# Altium project bottom board.PrjPcb
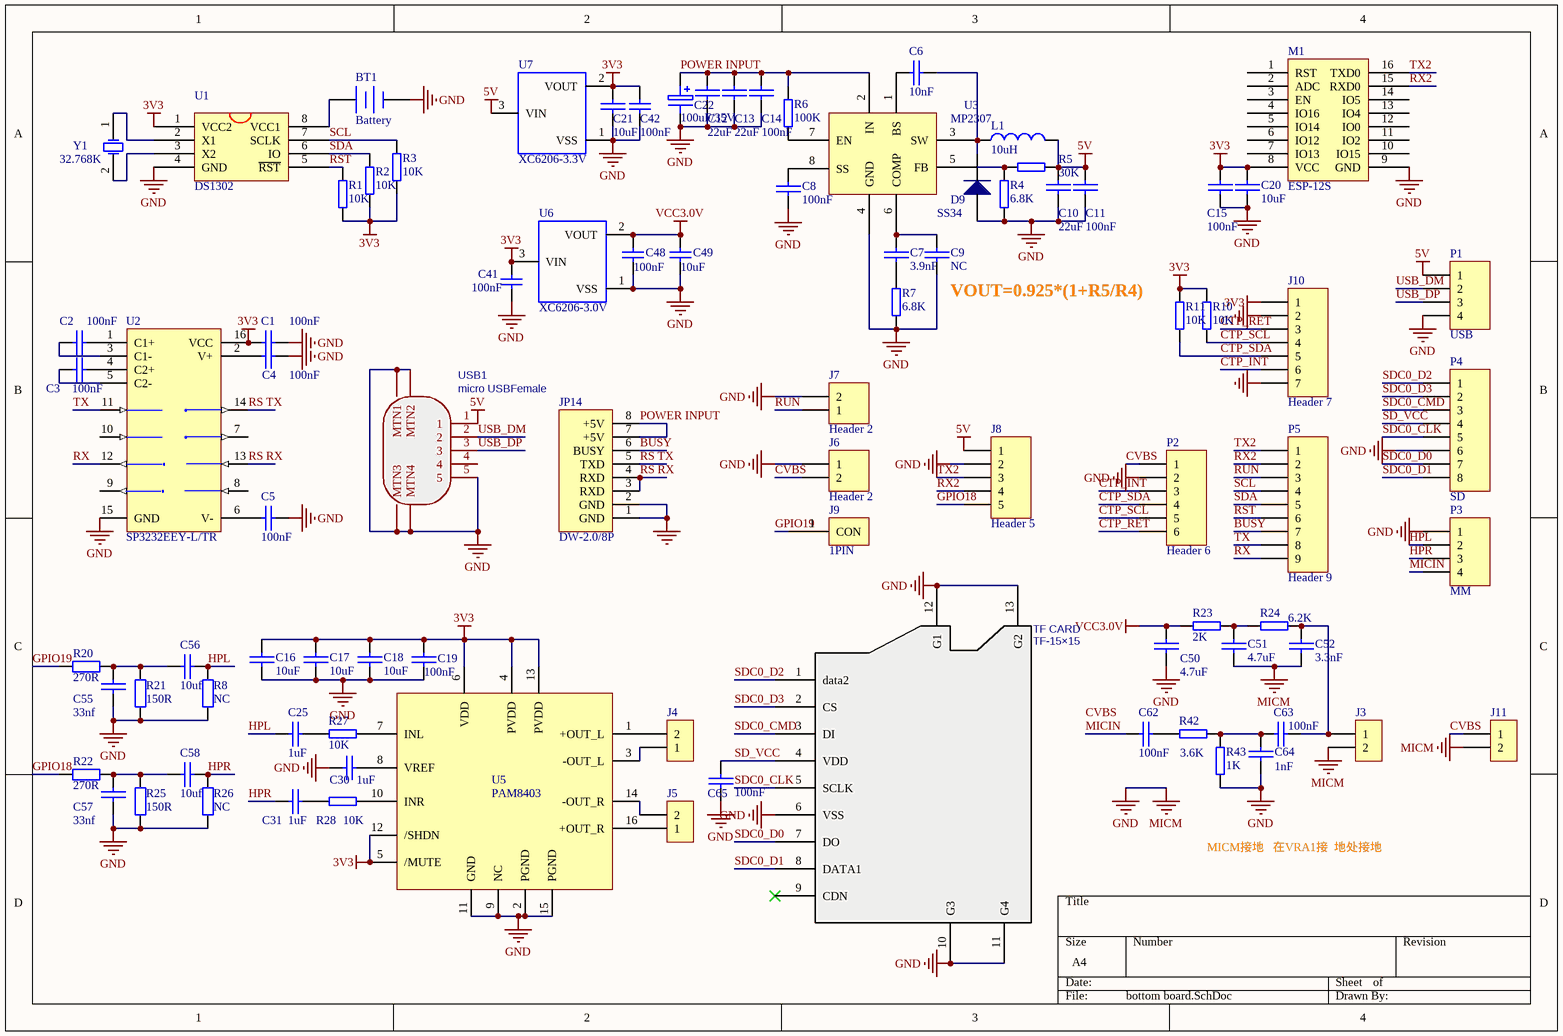
[diagram p0: bottom board.SchDoc]
1 sheet, 89 parts. Net scope: global (net labels, ports and power ports of the same name join across sheets).
Board file: bottom board.PcbDoc

## Sheet bottom board.SchDoc
size A4

### Parts
BT1  Battery  [CR1220]
C1  100nF  [0603]
C2  100nF  [0603]
C3  100nF  [0603]
C4  100nF  [0603]
C5  100nF  [0603]
C6  10nF  [0805]
C7  3.9nF  [0603]
C8  100nF  [0603]
C9  NC  [0603]
C10  22uF  [0805]
C11  100nF  [0603]
C12  22uF  [0805]
C13  22uF  [0805]
C14  100nF  [0603]
C15  100nF  [0603]
C16  10uF  [0603]
C17  10uF  [0603]
C18  10uF  [0603]
C19  100nF  [0603]
C20  10uF  [0603]
C21  10uF  [0603]
C22  100uF/35V  [CAP_SMD_6.5MM]
C25  1uF  [0603]
C30  1uF  [0603]
C31  1uF  [0603]
C41  100nF  [0603]
C42  100nF  [0603]
C48  100nF  [0603]
C49  10uF  [0603]
C50  4.7uF  [0603]
C51  4.7uF  [0603]
C52  3.3nF  [0603]
C55  33nf  [0603]
C56  10uf  [0603]
C57  33nf  [0603]
C58  10uf  [0603]
C62  100nF  [0603]
C63  100nF  [0603]
C64  1nF  [0603]
C65  100nF  [0603]
D9  SS34  [SMA]
J3  (no value)  [2PIN2.54-SMD]
J4  (no value)  [2PIN2.54-SMD]
J5  (no value)  [2PIN2.54-SMD]
J6  Header 2  [HDR1X2]
J7  Header 2  [HDR1X2]
J8  Header 5  [HDR1X5]
J9  1PIN  [1PIN]
J10  Header 7  [FPC-6PIN]
J11  (no value)  [2PIN2.54-SMD]
JP14  DW-2.0/8P  [DW2.0-8P-SMD]
L1  10uH  [LS8]
M1  ESP-12S  [ESP-12S]
P1  USB  [4PIN1.27]
P2  Header 6  [6PIN1.27]
P3  MM  [4PIN1.27]
P4  SD  [8PIN1.27]
P5  Header 9  [9PIN1.27]
R1  10K  [0603]
R2  10K  [0603]
R3  10K  [0603]
R4  6.8K  [0603]
R5  30K  [0603]
R6  100K  [0603]
R7  6.8K  [0603]
R8  NC  [0603]
R10  10K  [0603]
R11  10K  [0603]
R20  270R  [0603]
R21  150R  [0603]
R22  270R  [0603]
R23  2K  [0603]
R24  6.2K  [0603]
R25  150R  [0603]
R26  NC  [0603]
R27  10K  [0603]
R28  10K  [0603]
R42  3.6K  [0603]
R43  1K  [0603]
TF_CARD  TF-15×15  [SD_MICRO]
U1  DS1302  [SOP-8]
U2  SP3232EEY-L/TR  [SOIC-16]
U3  MP2307  [SOP-8]
U5  PAM8403  [SOIC-16]
U6  XC6206-3.0V  [SOT-23-3]
U7  XC6206-3.3V  [SOT-23-3]
USB1  micro USBFemale  [USB_MICRO]
Y1  32.768K  [SMD-3215]

### Nets
3V3: C1.2 C15.1 C16.1 C17.1 C18.1 C19.2 C20.2 C21.1 C41.1 C42.1 J10.1 M1.8(VCC) R1.1 R2.2 R3.2 R10.1 R11.1 U1.1(VCC2) U2.16(VCC) U5.4(PVDD) U5.5(/MUTE) U5.6(VDD) U5.12(/SHDN) U5.13(PVDD) U6.3(VIN) U7.2(VOUT)
5V: C10.1 C11.1 J8.1 L1.2 P1.1 R5.2 U7.3(VIN) USB1.1
GND: BT1.2(-) C1.1 C4.2 C5.1 C8.2 C9.2 C10.2 C11.2 C12.2 C13.2 C14.2 C15.2 C16.2 C17.2 C18.2 C19.1 C20.1 C21.2 C22.2 C30.2 C41.2 C42.2 C48.2 C49.1 C50.2 C51.2 C52.1 C55.1 C57.1 C64.1 C65.2 D9.1(A) J3.2 J6.1 J7.2 J8.2 J10.2 J10.7 J11.2 JP14.1(GND) JP14.2(GND) M1.9(GND) P1.4 P2.2 P3.1 P4.6 R4.2 R7.1 R8.1 R21.2 R25.1 R26.1 R43.1 TF_CARD.6(VSS) TF_CARD.10(G3) TF_CARD.11(G4) TF_CARD.12(G1) TF_CARD.13(G2) U1.4(GND) U2.15(GND) U3.4(GND) U5.2(PGND) U5.9(NC) U5.11(GND) U5.15(PGND) U6.1(VSS) U7.1(VSS) USB1.0(MTN4) USB1.5  [also labelled MICM]
VCC3.0V: C48.1 C49.2 C50.1 R23.2 U6.2(VOUT)
BUSY: JP14.6(BUSY) P5.7
CTP_INT: J10.6 P2.3
CTP_RET: J10.3 P2.6
CTP_SCL: J10.4 P2.5 R10.2
CTP_SDA: J10.5 P2.4 R11.2
CVBS: J6.2 J11.1 P2.1
GPIO18: J8.5 R22.1
GPIO19: J9.1(CON) R20.2
HPL: C25.2 C56.1 P3.2 R8.2
HPR: C31.2 C58.1 P3.3 R26.2
MICIN: C62.1 P3.4
POWER INPUT: C12.1 C13.1 C14.1 C22.1 JP14.7(+5V) JP14.8(+5V) R6.2 U3.2(IN)
RS RX: JP14.3(RXD) JP14.4(RXD) U2.13(R1IN)
RS TX: JP14.5(TXD) U2.14(T1OUT)
RST: P5.6 R1.2 U1.5(~{RST})
RUN: J7.1 P5.3
RX: P5.9 U2.12(R1OUT)
RX2: J8.4 M1.15(RXD0) P5.2
SCL: P5.4 R3.1 U1.7(SCLK)
SD_VCC: C65.1 P4.4 TF_CARD.4(VDD)
SDA: P5.5 R2.1 U1.6(IO)
SDC0_CLK: P4.5 TF_CARD.5(SCLK)
SDC0_CMD: P4.3 TF_CARD.3(DI)
SDC0_D0: P4.7 TF_CARD.7(DO)
SDC0_D1: P4.8 TF_CARD.8(DATA1)
SDC0_D2: P4.1 TF_CARD.1(data2)
SDC0_D3: P4.2 TF_CARD.2(CS)
TX: P5.8 U2.11(T1IN)
TX2: J8.3 M1.16(TXD0) P5.1
USB_DM: P1.2 USB1.2
USB_DP: P1.3 USB1.3
NetBT1_1: BT1.1(+) U1.8(VCC1)
NetC2_1: C2.1 U2.1(C1+)
NetC2_2: C2.2 U2.3(C1-)
NetC3_1: C3.1 U2.4(C2+)
NetC3_2: C3.2 U2.5(C2-)
NetC4_1: C4.1 U2.2(V+)
NetC5_2: C5.2 U2.6(V-)
NetC6_1: C6.1 D9.2(K) L1.1 U3.3(SW)
NetC6_2: C6.2 U3.1(BS)
NetC7_1: C7.1 C9.1 U3.6(COMP)
NetC7_2: C7.2 R7.2
NetC8_1: C8.1 U3.8(SS)
NetC25_1: C25.1 R27.2
NetC30_1: C30.1 U5.8(VREF)
NetC31_1: C31.1 R28.2
NetC51_1: C51.1 R23.1 R24.2
NetC52_2: C52.2 C63.2 J3.1 R24.1
NetC55_2: C55.2 C56.2 R20.1 R21.1
NetC57_2: C57.2 C58.2 R22.2 R25.2
NetC62_2: C62.2 R42.1
NetC63_1: C63.1 C64.2 R42.2 R43.2
NetJ4_1: J4.1 U5.3(-OUT_L)
NetJ4_2: J4.2 U5.1(+OUT_L)
NetJ5_1: J5.1 U5.16(+OUT_R)
NetJ5_2: J5.2 U5.14(-OUT_R)
NetR4_1: R4.1 R5.1 U3.5(FB)
NetR6_1: R6.1 U3.7(EN)
NetR27_1: R27.1 U5.7(INL)
NetR28_1: R28.1 U5.10(INR)
NetU1_2: U1.2(X1) Y1.1(OSC1)
NetU1_3: U1.3(X2) Y1.2(OSC2)

Not connected (* = marked no-connect by the designer): M1 1(RST) 2(ADC) 3(EN) 4(IO16) 5(IO14) 6(IO12) 7(IO13) 10(IO15) 11(IO2) 12(IO0) 13(IO4) 14(IO5); TF_CARD 9(CDN)*; U2 7(T2OUT) 8(R2IN) 9(R2OUT) 10(T2IN); USB1 4

### Notes on the sheet
- (near C9) VOUT=0.925*(1+R5/R4)
- MICM接地   在VRA1接  地处接地
- Labels drawn without touching a wire or pin: CVBS

### Library data of the parts
BT1 = Battery: Multicell Battery; Published: 24-Mar-1999; LatestRevisionDate: 17-Jul-2002; LatestRevisionNote: Re-released for DXP Platform.; PackageReference: BAT-2; Publisher: Altium Limited
C1-C21 C25 C30 C31 C50-C52 C62-C65 = CAP: Capacitor
C22 = ELECTRO1_W
C41 C42 C48 C49 = Cap: Capacitor; Published: 8-Jun-2000; LatestRevisionDate: 17-Jul-2002; LatestRevisionNote: Re-released for DXP Platform.; PackageReference: RAD-0.3; Publisher: Altium Limited; PackageDescription: Radial Cap, Thru-Hole; 2 Leads; 0.3 in Pin Spacing
C55-C58 = CAP_W
D9 = Diode
J3-J5 J11 = CON2: Connector
J6 J7 = Header 2: Header, 2-Pin; LatestRevisionDate: 17-Jul-2002; LatestRevisionNote: Re-released for DXP Platform.; Publisher: Altium Limited
J8 = Header 5: Header, 5-Pin; LatestRevisionDate: 17-Jul-2002; LatestRevisionNote: Re-released for DXP Platform.; Publisher: Altium Limited
J10 = Header 7: Header, 7-Pin; LatestRevisionDate: 17-Jul-2002; LatestRevisionNote: Re-released for DXP Platform.; Publisher: Altium Limited
L1 = Inductor: Code_IEC: 1005; Value: 10mH; Published: 8-Jun-2000; LatestRevisionDate: 29-May-2009; LatestRevisionNote: IPC-7351 Footprint Added.; PackageReference: 0402-A; Publisher: Altium Limited; PackageDescription: Chip Inductor; Code_JEITA: 0402
P1 P3 = Header 4: Header, 4-Pin; LatestRevisionDate: 17-Jul-2002; LatestRevisionNote: Re-released for DXP Platform.; Publisher: Altium Limited
P2 = Header 6: Header, 6-Pin; LatestRevisionDate: 17-Jul-2002; LatestRevisionNote: Re-released for DXP Platform.; Publisher: Altium Limited
P4 = Header 8: Header, 8-Pin; LatestRevisionDate: 17-Jul-2002; LatestRevisionNote: Re-released for DXP Platform.; Publisher: Altium Limited
P5 = Header 9: Header, 9-Pin; LatestRevisionDate: 17-Jul-2002; LatestRevisionNote: Re-released for DXP Platform.; Publisher: Altium Limited
R1-R7 R10 R11 R23 R24 R27 R28 R42 R43 = RES2
R8 R20-R22 R25 R26 = Res2: Resistor; Value: 1K; Published: 8-Jun-2000; LatestRevisionDate: 17-Jul-2002; LatestRevisionNote: Re-released for DXP Platform.; PackageReference: AXIAL-0.4; Publisher: Altium Limited
TF_CARD = TF-15×15: BOM_Manufacturer: SOFNG; BOM_Supplier: LCSC; BOM_Manufacturer Part: TF-15×15; spicePre: C; BOM_Supplier Part: C111196
U2 = SP3232EEY-L/TR: RS232; ComponentLink1Description: 供应商链接; ComponentLink1URL: http://www.szlcsc.com/product/details_14131.html; Package: TSSOP-16; Supplier: LC; SuppliersPartNumber: C13482
U5 = SC8403
U6 U7 = XC6206: pin to pad: 1>2 2>3 3>1
USB1 = micro USBFemale: BOM_Manufacturer: ValuePro; BOM_Supplier: LCSC; BOM_Manufacturer Part: micro USBFemale; image: //image.lceda.cn/szlcsc/C10418.jpg; spicePre: U; BOM_Supplier Part: C10418
Y1 = XTAL: Crystal Oscillator; Published: 8-Jun-2000; LatestRevisionDate: 17-Jul-2002; LatestRevisionNote: Re-released for DXP Platform.; PackageReference: R38; Publisher: Altium Limited